# Altium project kiwi_23_usb_charger_v1.0.PrjPcb
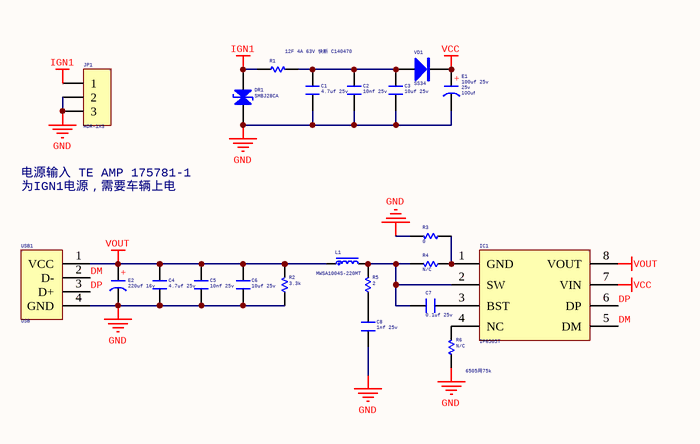
[diagram p0: kiwi_23_usb_charger_v1.0.schdoc]
1 sheet, 22 parts. Net scope: global (net labels, ports and power ports of the same name join across sheets).
Board file: kiwi_23_usb_charger_v1.0.PCBDOC

## Sheet kiwi_23_usb_charger_v1.0.schdoc: AT long bus (13.3 x 4.2 inches)
size A4; Organization: Organization; Address1: Address1; Address2: Address2; Address3: Address3; Address4: Address4; DocumentNumber: 1; Revision: 0; SheetNumber: 2; SheetTotal: 2

### Parts
C1  4.7uf 25v  [C 0805]
C2  10nf 25v  [C 0805]
C3  10uf 25v  [C 0805]
C4  4.7uf 25v  [C 0805]
C5  10nf 25v  [C 0805]
C6  10uf 25v  [C 0805]
C7  0.1uf 25v  [C 0603]
C8  1nf 25v  [C 0603]
DR1  SMBJ28CA  [SMB]
E1  100uf 25v  value 100uf  Voltage: 25v  [CM D(6.3*7.7)]
E2  220uf 16v  [CM D(6.3*7.7)]
IC1  IP6505T  [SOP8_EPAD_L]
JP1  HDR-1X3  [TE AMP 175781-1-ND]
L1  MWSA1004S-220MT  [IND-SMD_L11.5-W10.0_FXL1040]
R1  12F 4A 63V 快断 C140470  [R 1206-HP]
R2  3.3k  [R 0603]
R3  0  [R 0603]
R4  N/C  [R 0603]
R5  2  [R 0603]
R6  N/C  [R 0603]
USB1  USB  [USB-A/S_A]
VD1  SS34  [SMB]

### Nets
GND: C1.1 C2.1 C3.1 C4.1 C5.1 C6.1 C8.2 DR1.2(K) E1.2 E2.2 JP1.2 JP1.3 R2.1 R3.2 R6.1 USB1.4(GND)
IGN1: DR1.1(A) JP1.1 R1.1
VCC: E1.1 IC1.7(VIN) VD1.2(K)
VOUT: C4.2 C5.2 C6.2 E2.1 IC1.8(VOUT) L1.1 R2.2 USB1.1(VCC)
DM: IC1.5(DM) USB1.2(D-)
DP: IC1.6(DP) USB1.3(D+)
NetC1_2: C1.2 C2.2 C3.2 R1.2 VD1.1(A)
NetC7_1: C7.1 IC1.3(BST)
NetC7_2: C7.2 IC1.2(SW) L1.2 R4.2 R5.2
NetC8_1: C8.1 R5.1
NetIC1_1: IC1.1(GND) R3.1 R4.1
NetIC1_4: IC1.4(NC) R6.2

### Notes on the sheet
- 电源输入 TE AMP 175781-1
- 为IGN1电源，需要车辆上电
- (near R6) 6505用75k
- (in symbol C-CM) +

### Library data of the parts
C1-C8 = C: 无极性贴片电容; Voltage: 25v
  C1 C4: Value: 4.7uf
  C2 C5: Value: 10nf
  C3 C6: Value: 10uf
  C7: Value: 0.1uf
  C8: Value: 1nf
DR1 = DR: 瞬态电压抑制二极管
E1 E2 = C-CM: 贴片电解电容
  E2: Voltage: 16v; Value: 220uf
IC1 = IP6505T: DCP/QC2.0/QC3.0/MTK PE1.1/PE2.0/FCP/SCP/AFC/SFCP 单A口降压模式快充管理器
JP1 = Header 3: 3P接插件
L1 = L-CDRH: 功率屏蔽电感; Value: MWSA1004S-220MT
R1-R6 = R: 贴片电阻
  R1: Value: 12F 4A 63V 快断 C140470
  R2: Value: 3.3k
  R3: Value: 0
  R4 R6: Value: N/C
  R5: Value: 2
USB1 = USB-A/S: USB-A型母接口
VD1 = SS34: 肖特基二极管